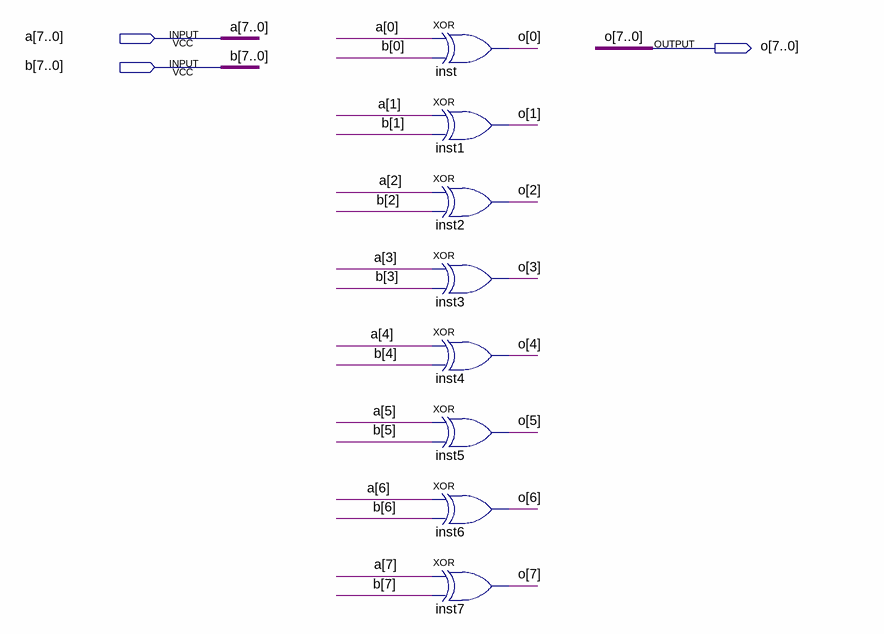
[diagram p0: schematic sheet]
// Quartus schematic 8bitxor.bdf as structural Verilog: 8 symbols, 3 pins
module \8bitxor  (
  input  [7:0] a,
  input  [7:0] b,
  output [7:0] o
);

  xor inst (o[0], a[0], b[0]);
  xor inst1 (o[1], a[1], b[1]);
  xor inst2 (o[2], a[2], b[2]);
  xor inst3 (o[3], a[3], b[3]);
  xor inst4 (o[4], a[4], b[4]);
  xor inst5 (o[5], a[5], b[5]);
  xor inst6 (o[6], a[6], b[6]);
  xor inst7 (o[7], a[7], b[7]);
endmodule
